# EasyEDA Pro project ProPrj_STM32H730_ESP-Hosted_EVB_2025-02-02.epro, schematic Schematic1

## Sheets
1 Power: Board Name: Board1; Create Date: 2024-12-31; Page Name: Power; Project Name: STM32H730_ESP-Hosted_EVB; Schematic Name: Schematic1; Update Date: 2025-01-24; Company: 嘉立创EDA; Page Size: A4; Version: V1.0
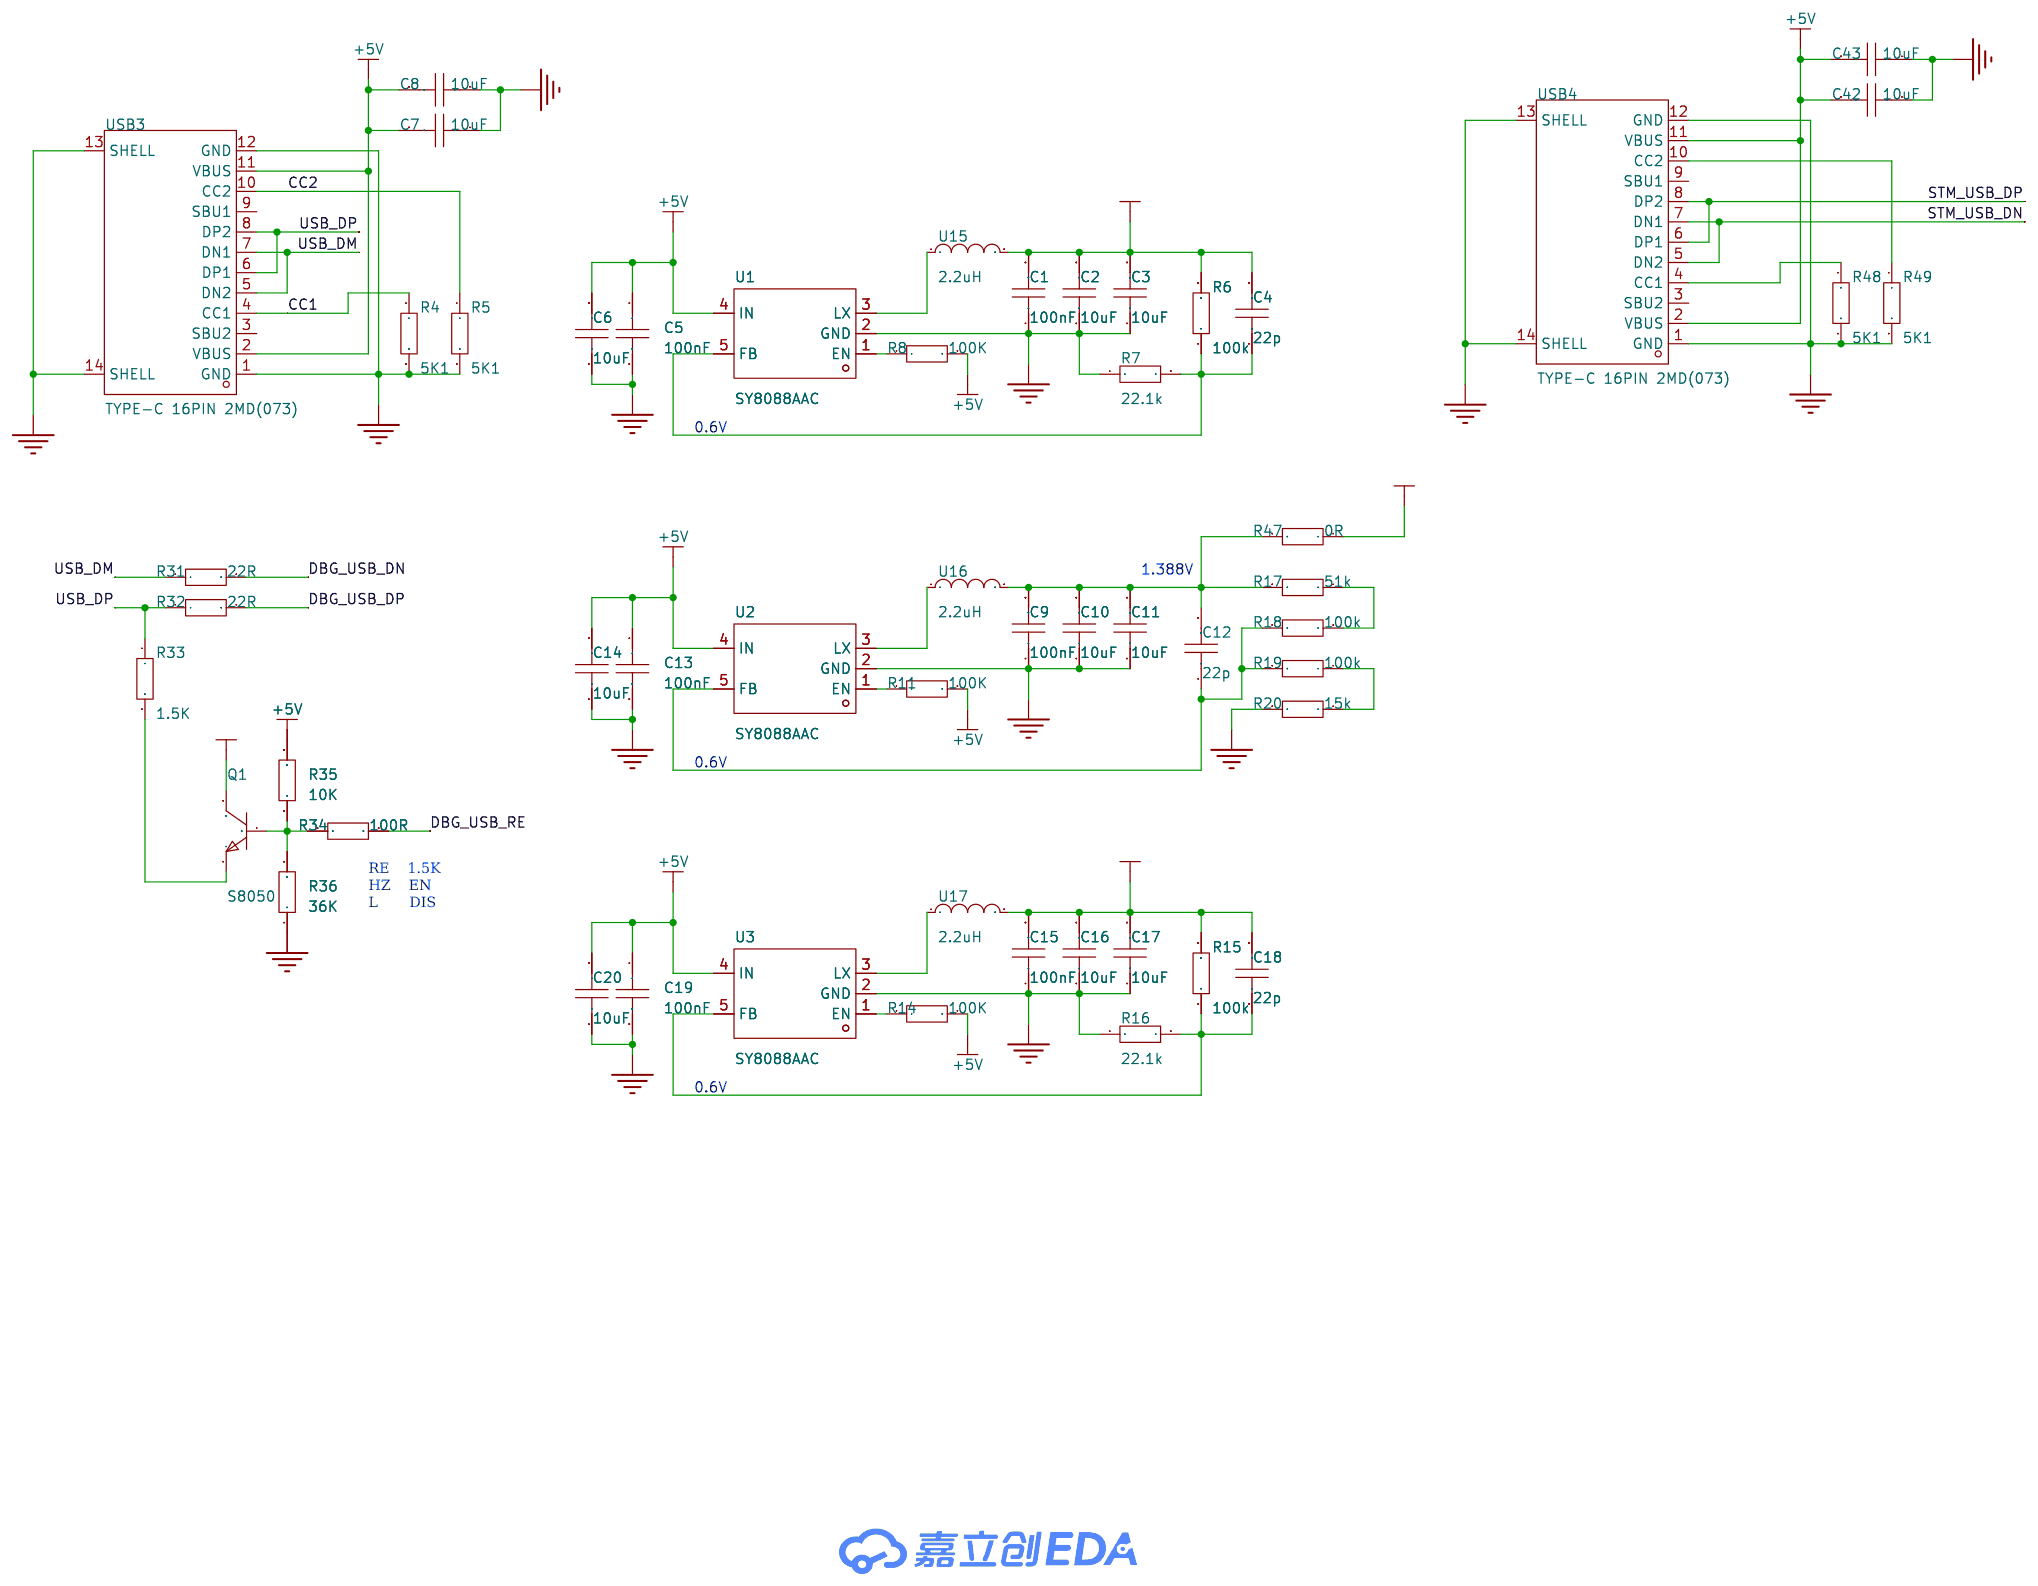
[diagram p0: Power]
2 Debugger: Page Name: Debugger; Update Date: 2025-01-29
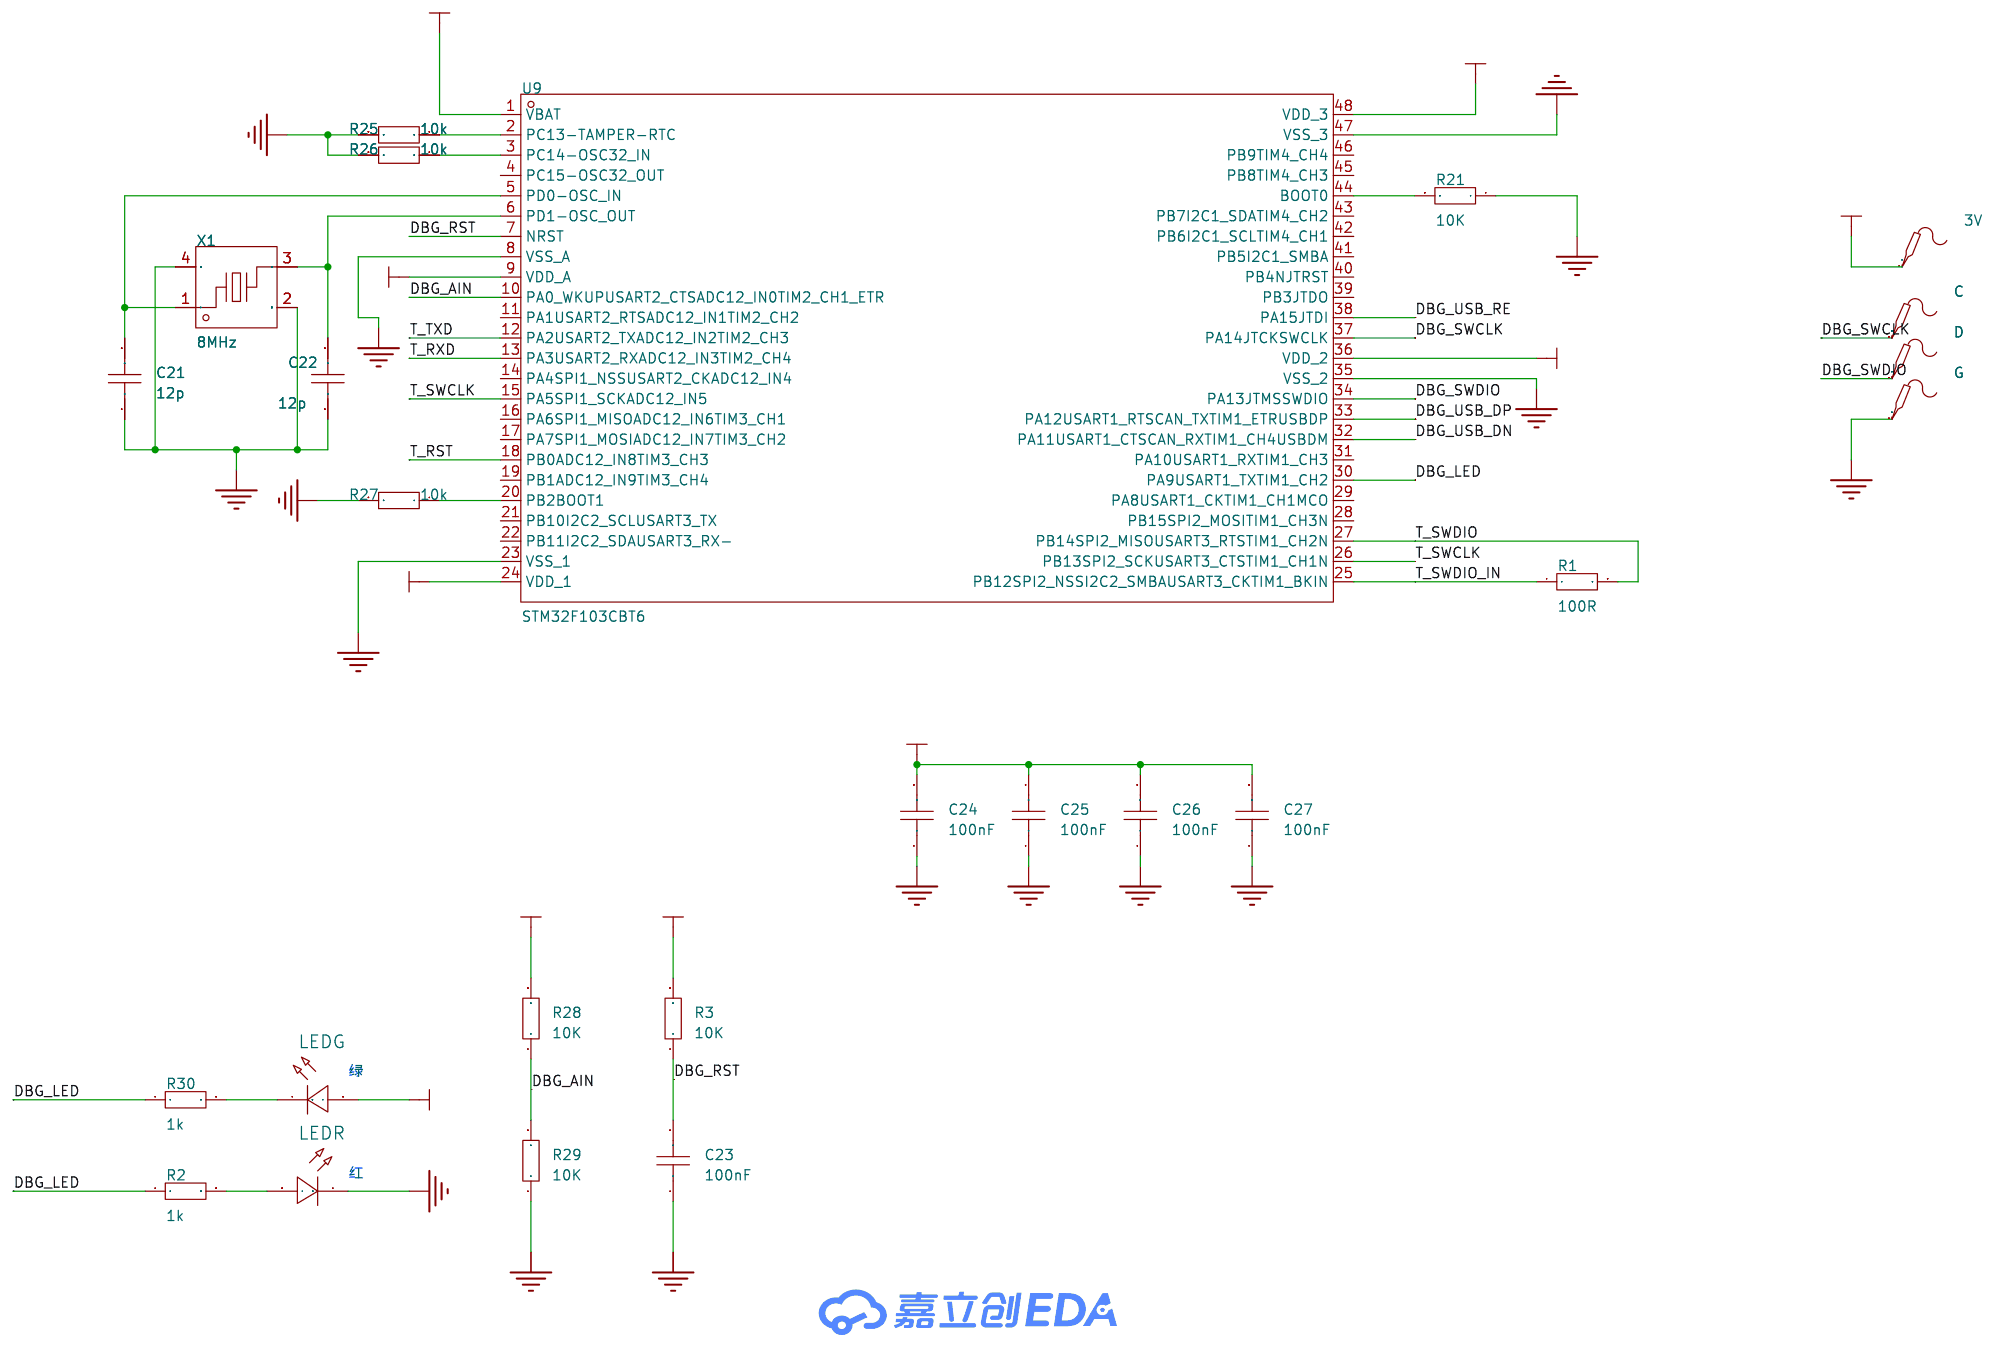
[diagram p1: Debugger]
3 ESP32: Page Name: ESP32; Update Date: 2025-01-29
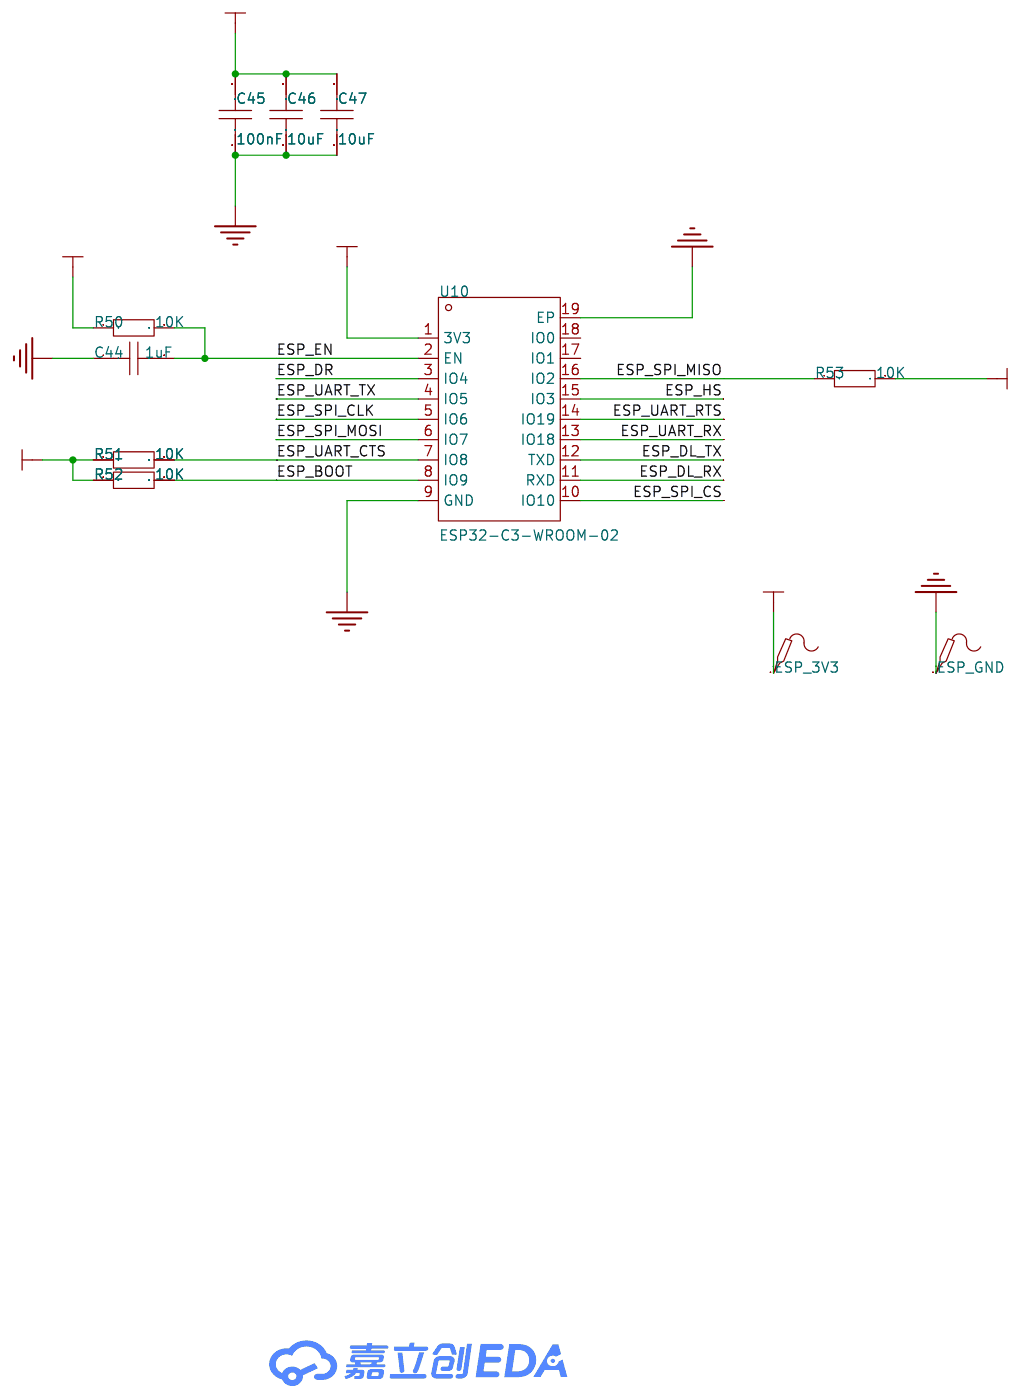
[diagram p2: ESP32]
4 Conn
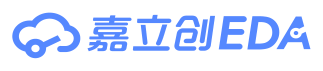
[diagram p3: Conn]
5 MCU: Create Date: 2025-01-01; Page Name: MCU; Update Date: 2025-01-29
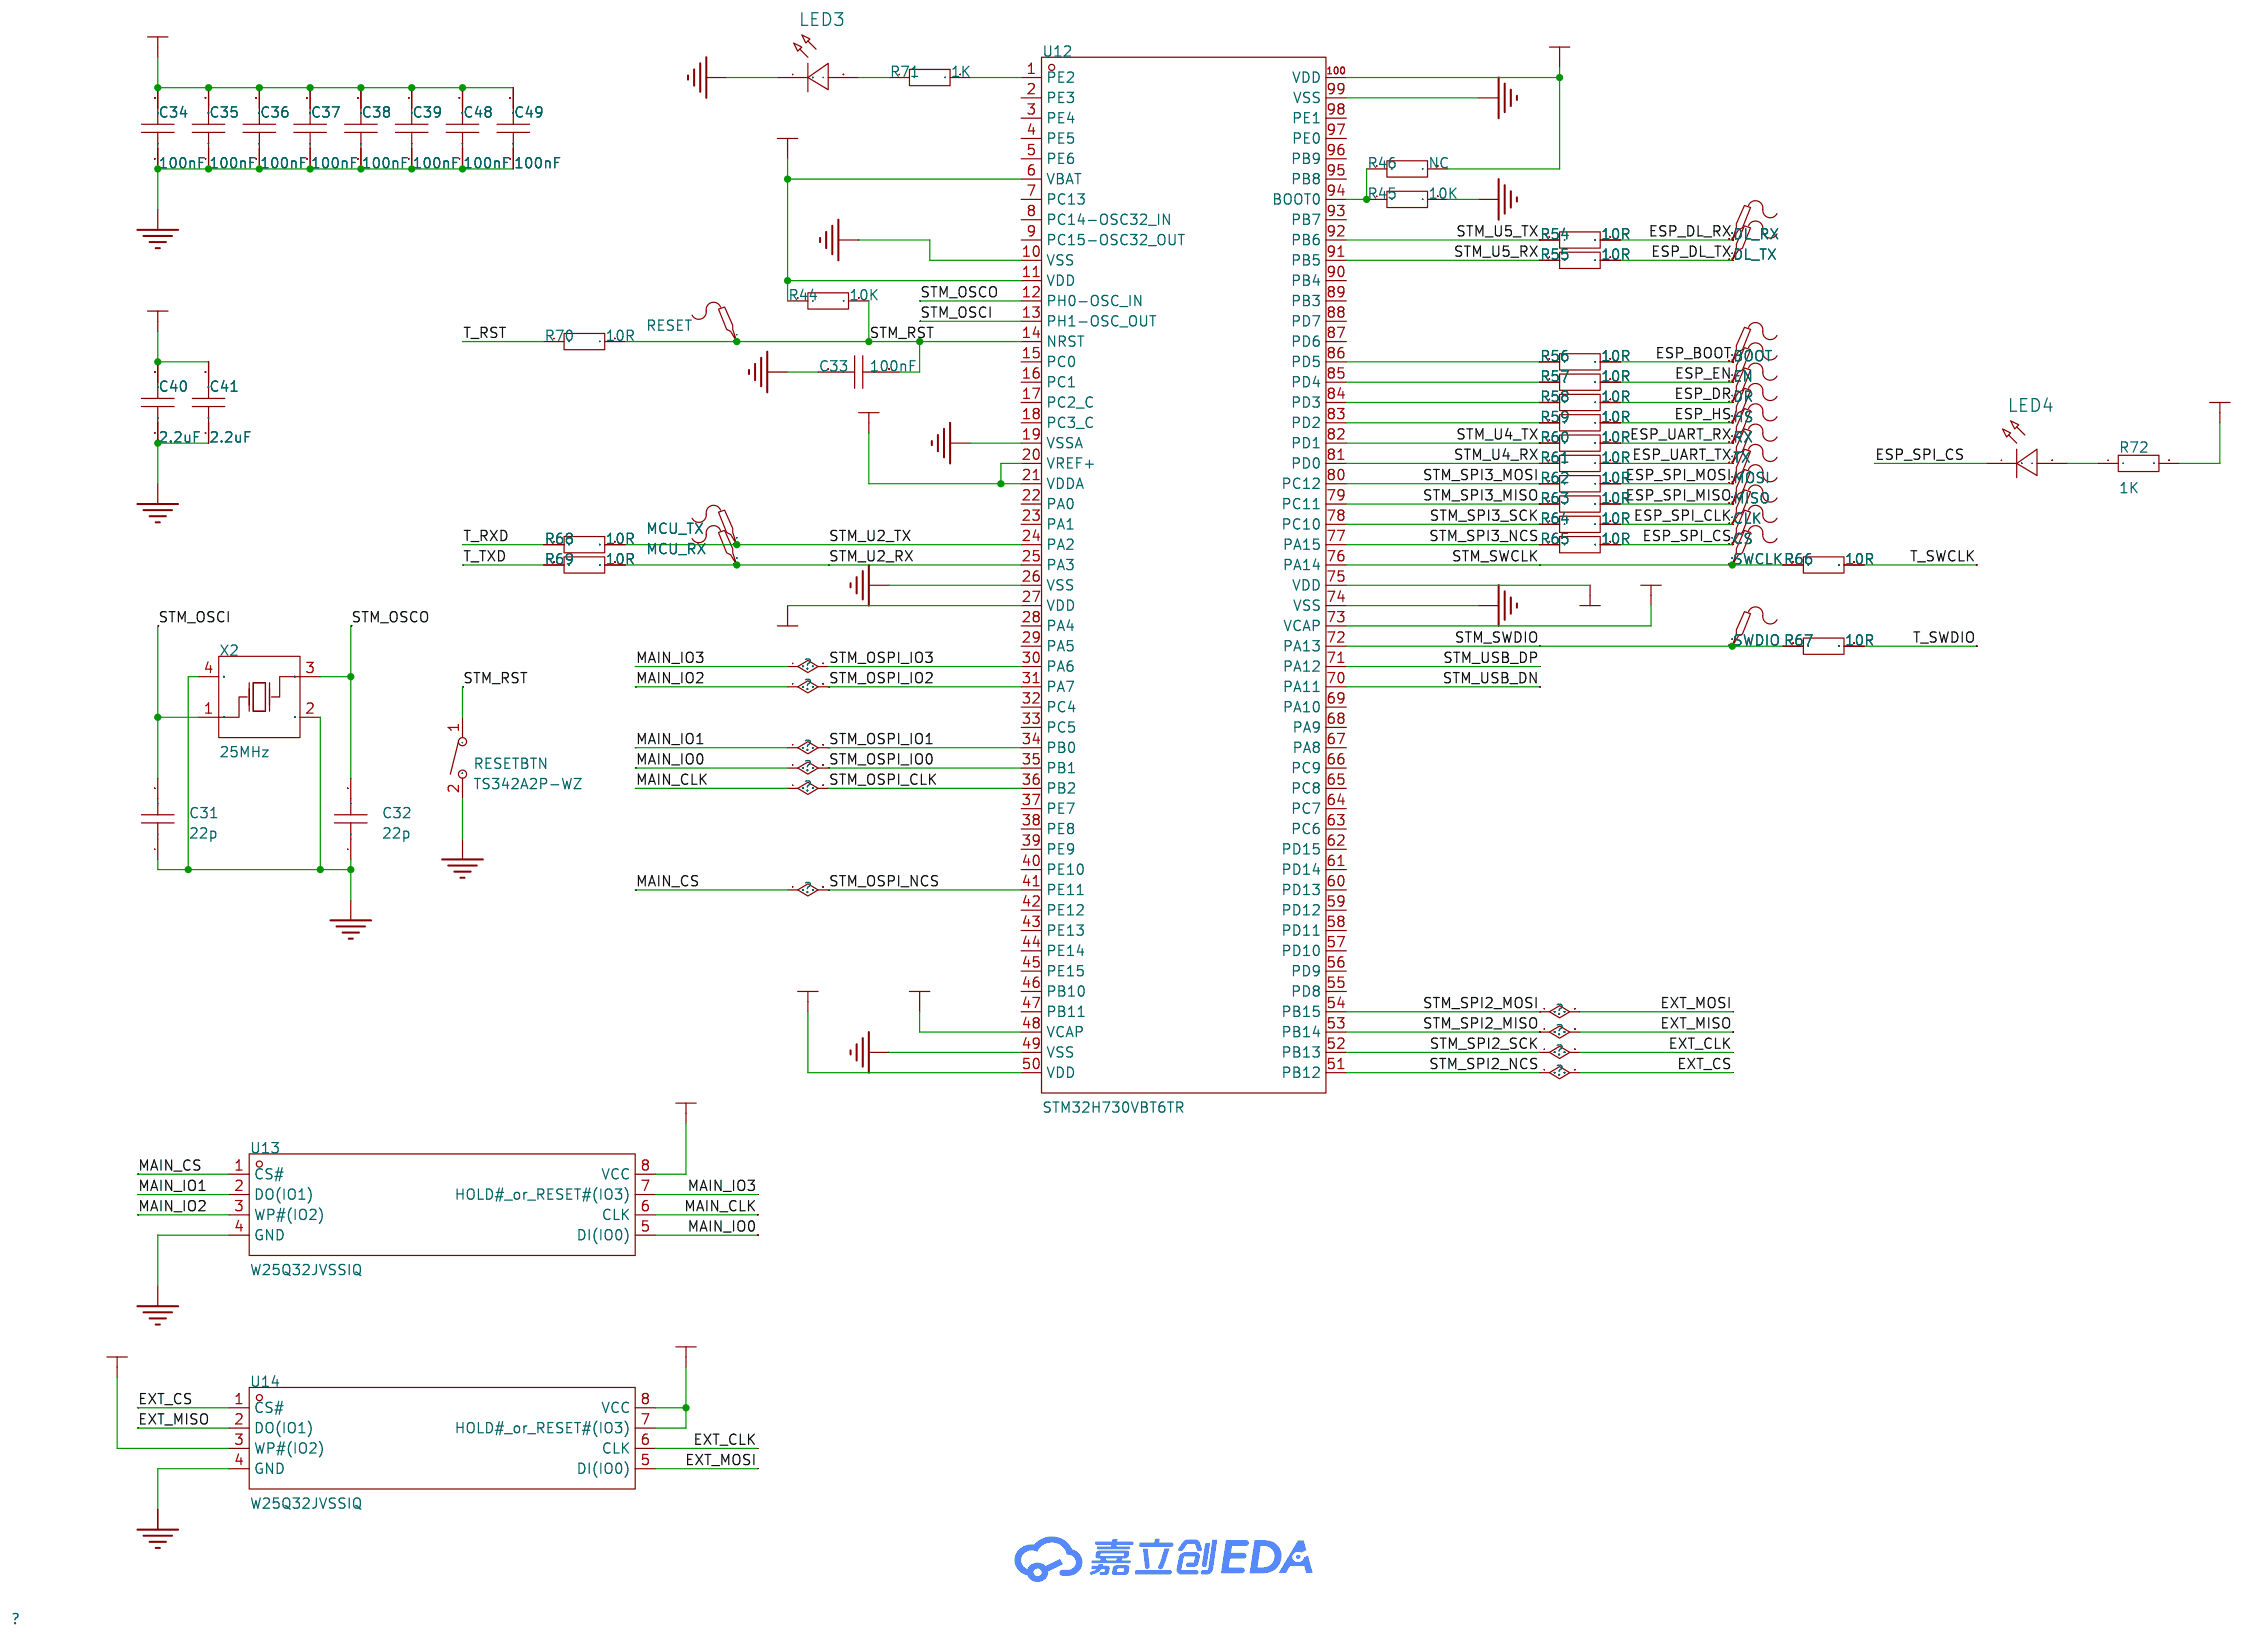
[diagram p4: MCU]

## Parts
sheet Debugger
3V  -  [Test-Point-0.5mm]
C  -  [Test-Point-0.5mm]
C21  12p  [C0603]
C22  12p  [C0603]
C23  100nF  [C0603]
C24  100nF  [C0603]
C25  100nF  [C0603]
C26  100nF  [C0603]
C27  100nF  [C0603]
D  -  [Test-Point-0.5mm]
G  -  [Test-Point-0.5mm]
LEDG  -  [LED_0603]
LEDR  -  [LED_0603]
R1  100R  [R0603]
R2  1k  [R0603]
R3  10K  [R0603]
R21  10K  [R0603]
R25  10k  [R0603]
R26  10k  [R0603]
R27  10k  [R0603]
R28  10K  [R0603]
R29  10K  [R0603]
R30  1k  [R0603]
U9  STM32F103CBT6  [LQFP-48_L7.0-W7.0-P0.50-LS9.0-BL]
X1  8MHz  [OSC-SMD_4P-L3.2-W2.5-BL]
sheet ESP32
C44  1uF  [C0603]
C45  100nF  [C0603]
C46  10uF  [C0603]
C47  10uF  [C0603]
ESP_3V3  -  [Test-Point-0.5mm]
ESP_GND  -  [Test-Point-0.5mm]
R50  10K  [R0603]
R51  10K  [R0603]
R52  10K  [R0603]
R53  10K  [R0603]
U10  ESP32-C3-WROOM-02  [BULETM-SMD_ESPRESSIF_ESP32-C3-WROOM-02-N4-4MB]
sheet MCU
BOOT  -  [Test-Point-0.5mm]
C31  22p  [C0603]
C32  22p  [C0603]
C33  100nF  [C0603]
C34  100nF  [C0603]
C35  100nF  [C0603]
C36  100nF  [C0603]
C37  100nF  [C0603]
C38  100nF  [C0603]
C39  100nF  [C0603]
C40  2.2uF  [C0603]
C41  2.2uF  [C0603]
C48  100nF  [C0603]
C49  100nF  [C0603]
CLK  -  [Test-Point-0.5mm]
CS  -  [Test-Point-0.5mm]
DL_RX  -  [Test-Point-0.5mm]
DL_TX  -  [Test-Point-0.5mm]
DR  -  [Test-Point-0.5mm]
EN  -  [Test-Point-0.5mm]
HS  -  [Test-Point-0.5mm]
LED3  -  [LED_0603]
LED4  -  [LED_0603]
MCU_RX  -  [Test-Point-0.5mm]
MCU_TX  -  [Test-Point-0.5mm]
MISO  -  [Test-Point-0.5mm]
MOSI  -  [Test-Point-0.5mm]
R44  10K  [R0603]
R45  10K  [R0603]
R46  NC  [R0603]
R54  10R  [R0603]
R55  10R  [R0603]
R56  10R  [R0603]
R57  10R  [R0603]
R58  10R  [R0603]
R59  10R  [R0603]
R60  10R  [R0603]
R61  10R  [R0603]
R62  10R  [R0603]
R63  10R  [R0603]
R64  10R  [R0603]
R65  10R  [R0603]
R66  10R  [R0603]
R67  10R  [R0603]
R68  10R  [R0603]
R69  10R  [R0603]
R70  10R  [R0603]
R71  1K  [R0603]
R72  1K  [R0603]
RESET  -  [Test-Point-0.5mm]
RESETBTN  TS342A2P-WZ  [SW-SMD_L4.0-W2.9-LS5.0]
RX  -  [Test-Point-0.5mm]
SWCLK  -  [Test-Point-0.5mm]
SWDIO  -  [Test-Point-0.5mm]
TX  -  [Test-Point-0.5mm]
U12  STM32H730VBT6TR  [LQFP-100_L14.0-W14.0-P0.50-LS16.0-BL]
U13  W25Q32JVSSIQ  [SOIC-8_L5.3-W5.3-P1.27-LS8.0-BL]
U14  W25Q32JVSSIQ  [SOIC-8_L5.3-W5.3-P1.27-LS8.0-BL]
X2  25MHz  [OSC-SMD_4P-L3.2-W2.5-BL]
sheet Power
C1  100nF  [C0603]
C2  10uF  [C0603]
C3  10uF  [C0603]
C4  22p  [C0603]
C5  100nF  [C0603]
C6  10uF  [C0603]
C7  10uF  [C0603]
C8  10uF  [C0603]
C9  100nF  [C0603]
C10  10uF  [C0603]
C11  10uF  [C0603]
C12  22p  [C0603]
C13  100nF  [C0603]
C14  10uF  [C0603]
C15  100nF  [C0603]
C16  10uF  [C0603]
C17  10uF  [C0603]
C18  22p  [C0603]
C19  100nF  [C0603]
C20  10uF  [C0603]
C42  10uF  [C0603]
C43  10uF  [C0603]
Q1  S8050  [SOT-23-3_L3.0-W1.7-P0.95-LS2.9-BR]
R4  5K1  [R0603]
R5  5K1  [R0603]
R6  100k  [R0603]
R7  22.1k  [R0603]
R8  100K  [R0603]
R11  100K  [R0603]
R14  100K  [R0603]
R15  100k  [R0603]
R16  22.1k  [R0603]
R17  51k  [R0603]
R18  100k  [R0603]
R19  100k  [R0603]
R20  15k  [R0603]
R31  22R  [R0603]
R32  22R  [R0603]
R33  1.5K  [R0603]
R34  100R  [R0603]
R35  10K  [R0603]
R36  36K  [R0603]
R47  0R  [R0603]
R48  5K1  [R0603]
R49  5K1  [R0603]
U1  SY8088AAC  [SOT-23-5_L3.0-W1.7-P0.95-LS2.8-BR]
U2  SY8088AAC  [SOT-23-5_L3.0-W1.7-P0.95-LS2.8-BR]
U3  SY8088AAC  [SOT-23-5_L3.0-W1.7-P0.95-LS2.8-BR]
U15  2.2uH  [IND-SMD_L2.5-W2.0]
U16  2.2uH  [IND-SMD_L2.5-W2.0]
U17  2.2uH  [IND-SMD_L2.5-W2.0]
USB3  TYPE-C 16PIN 2MD(073)  [USB-C-SMD_TYPE-C-6PIN-2MD-073]
USB4  TYPE-C 16PIN 2MD(073)  [USB-C-SMD_TYPE-C-6PIN-2MD-073]

## Library data of the parts
3V BOOT C CLK CS D DL_RX DL_TX DR EN ESP_3V3 ESP_GND G HS MCU_RX MCU_TX MISO MOSI RESET RX SWCLK SWDIO TX = Test-Point: Test Point 测试点
C1-C27 C31-C49 = CAP_0603: Supplier Footprint: 0603
LED3 LED4 LEDG LEDR = LED_0603-R: Supplier Footprint: 0603
R1-R8 R11 R14-R21 R25-R36 R44-R72 = Res_0603: Supplier Footprint: 0603
U9 = STM32F103CBT6: CPU内核:CM3;程序存储容量:128KB;RAM总容量:20KB;GPIO端口数量:37;工作电压范围:2V~3.6V;CPU最大主频:72MHz;程序存储器类型:FLASH;; Supplier Part: C8304; Manufacturer: ST(意法半导体); Supplier Footprint: LQFP-48(7x7); JLCPCB Part Class: 扩展库; Datasheet: https://atta.szlcsc.com/upload/public/pdf/source/20150811/1457707344439.pdf; Supplier: LCSC; CPU Core: CM3; Program Storage Size: 128KB; RAM Size: 20KB; GPIO Ports Number: 37; Operating Voltage Range: 2V~3.6V; CPU Maximum Speed: 72MHz; Program Memory Type: FLASH; Operating Temperature Range: -40℃~+85℃; ADC (Bit): 12bit; Universal Serial Bus: 有; Peripheral/Function: DMA；片载温度传感器；PWM; Watchdog: 有; Infrared Data Association: 有; Low-Voltage Detect: 有; Direct Memory Access: 有; Internal Oscillator: 有
X1 = X32258MOB4SI: 频率:8MHz;频率公差:±10ppm;负载电容:12pF;; LCSC Part Name: 8MHz ±10ppm 12pF YSX321SL; Supplier Part: C2682775; Manufacturer: YXC(扬兴晶振); Supplier Footprint: SMD3225-4P; Datasheet: https://atta.szlcsc.com/upload/public/pdf/source/20210106/C2682774_0CD4FDA5D9DA3FBEEC23BD607A48E4B0.pdf; Supplier: LCSC; Crystal Type: 贴片无源晶振; Frequency Tolerance: ±10ppm; Frequency Stability: ±30ppm; Load Capacitance: 12pF; Equivalent Series Resistance (ESR): 150Ω; Operating Temperature: -40℃~+85℃
U10 = ESP32-C3-WROOM-02-N4: 核心处理器:ESP32-C3芯片;频率:2.4GHz;发射功率:20.5dBm;; Supplier Part: C2934560; Manufacturer: ESPRESSIF(乐鑫); Supplier Footprint: VFQFN-32-EP; JLCPCB Part Class: 扩展库; Datasheet: https://atta.szlcsc.com/upload/public/pdf/source/20220106/F07459EFFE1D7CBA94B4FB8A075146A6.pdf; Supplier: LCSC; Core Processor: ESP32-C3芯片; Support Interface: I2C；GPIO；SPI；JTAG；UART；USB；I2S; Output Power: 20.5dBm
RESETBTN = TS342A2P-WZ: 电路结构:单刀单掷;按钮形状:圆形按钮;安装方式:立贴;开关长度:3.95mm;开关宽度:2.9mm;开关高度:2mm;带支架:不带;触点电流:50mA;额定电压(DC):12V;绝缘电阻:100MΩ;机械寿命:3万次;; LCSC Part Name: 3.95*2.9*2mm 立贴 轻触开关; Supplier Part: C557591; Manufacturer: SHOU HAN(首韩); Supplier Footprint: SMD; JLCPCB Part Class: 扩展库; Datasheet: https://atta.szlcsc.com/upload/public/pdf/source/20200519/C557591_B3A5A21584733303F06306F18577DA8B.pdf; Supplier: LCSC; Circuit: 单刀单掷; Actuator Style: 圆形按钮; Mounting Style: 立贴; Switch Length: 3.95mm; Switch Width: 2.9mm; Switch Height: 2mm; Strike Gundam: 不带; Contact Current: 50mA; Voltage Rating (DC): 12V; Insulation Resistance: 100MΩ; Actuator/Cap Color: 黑色; Pin Style: SMD接片; Mechanical Life: 3万次; Operating Temperature: -25℃~+70℃
U12 = STM32H730VBT6TR: CPU内核:ARM-M系列;GPIO端口数量:80;工作电压范围:1.71V~3.6V;CPU最大主频:550MHz;; Supplier Part: C5931908; Manufacturer: ST(意法半导体); Supplier Footprint: LQFP-100(14x14); JLCPCB Part Class: 扩展库; Supplier: LCSC; CPU Core: ARM-M系列; GPIO Ports Number: 80; Operating Voltage Range: 1.71V~3.6V; CPU Maximum Speed: 550MHz; Operating Temperature Range: -40℃~+85℃; ADC (Bit): 12bit；16bit; DAC (Bit): 12bit; Universal Serial Bus: 有; Secure Digital Input and Output: 有; Direct Memory Access: 有
U13 U14 = W25Q32JVSSIQ: Supplier Part: C179173; Manufacturer: WINBOND(华邦); Supplier Footprint: SOP-8-208mil; JLCPCB Part Class: 扩展库; Datasheet: https://atta.szlcsc.com/upload/public/pdf/source/20191218/C179173_5BBD793D2D7B3672E140BC7AE85C11FF.pdf; Supplier: LCSC
X2 = X322525MOB4SI: 晶振类型:贴片晶振;频率:25MHz;常温频差:±10ppm;外接负载电容:12pF;频率稳定度(全温):±30ppm;; LCSC Part Name: 25MHz ±10ppm 12pF; Supplier Part: C9006; Manufacturer: YXC(扬兴晶振); Supplier Footprint: SMD3225-4P; JLCPCB Part Class: 基础库; Datasheet: https://atta.szlcsc.com/upload/public/pdf/source/20210329/C112971_1F611BDC486E193C1706F6D8EB5AA189.pdf; Supplier: LCSC; Crystal Type: 贴片晶振; Normal temperature Frequency Tolerance: ±10ppm; External load capacitor: 12pF; Frequency Stability(Full temperature range): ±30ppm; Operating Temperature: -40℃~+85℃
Q1 = S8050 J3Y(RANGE:200-350): 晶体管类型:NPN;集电极电流(Ic):500mA;集射极击穿电压(Vceo):25V;功率(Pd):300mW;直流电流增益(hFE@Ic,Vce):200@500mA,1V;; LCSC Part Name: NPN 电流:500mA 耐压:25V H档(200-350); Supplier Part: C2146; Manufacturer: CJ(江苏长电/长晶); Supplier Footprint: SOT-23; JLCPCB Part Class: 基础库; Datasheet: https://atta.szlcsc.com/upload/public/pdf/source/20231013/FF37B6A000E6CDA75C9C999D2E78731F.pdf; Supplier: LCSC; Transistor Type: NPN; Collector Current (Ic): 500mA; Collector-Emitter Breakdown Voltage (Vceo): 25V; Power Dissipation (Pd): 300mW; DC Current Gain (hFE@Ic,Vce): 200@500mA,1V; Transition Frequency (fT): 150MHz; Collector Cut-Off Current (Icbo): 100nA; Collector-Emitter Saturation Voltage (VCE(sat)@Ic,Ib): 600mV@500mA,50mA; Operating Temperature: -55℃~+150℃
U1-U3 = SY8088AAC: 功能类型:降压型;输出类型:-;工作电压:2.5V~5.5V;输出电压:-;输出电流:-;; LCSC Part Name: 1.5MHz 1A 同步降压DC/DC调节器; Supplier Part: C79313; Manufacturer: silergy(矽力杰); Supplier Footprint: SOT-23-5; JLCPCB Part Class: 扩展库; Datasheet: https://atta.szlcsc.com/upload/public/pdf/source/20170329/1490752163260.pdf; Supplier: LCSC; Function: 降压型; Input Voltage: 2.5V~5.5V; Switching Frequency: 1.5MHz; Operating Temperature: -40℃~+125℃; Synchronous Rectification: 是; Number of Outputs: 1; Topology: 降压式; Quiescent Current (Iq): 40uA
U15-U17 = FTC252012S3R3MBCA: 电感值:3.3uH;精度:±20%;额定电流:2.3A;饱和电流(Isat):3A;类型:一体成型电感;; LCSC Part Name: 3.3uH ±20% 3A; Supplier Part: C5832373; Manufacturer: cjiang(长江微电); Supplier Footprint: SMD,2x2.5mm; JLCPCB Part Class: 扩展库; Datasheet: https://atta.szlcsc.com/upload/public/pdf/source/20230602/8FFEDA9C0247A92A0D4B67554BFE4091.pdf; Supplier: LCSC; Tolerance: ±20%; Rated Current: 2.3A; Saturation Current (Isat): 3A; DC Resistance (DCR): 80mΩ; Type: 一体成型电感
USB3 USB4 = TYPE-C 16PIN 2MD(073): 连接器类型:Type-C;标准:-;公母:母;触点数量:16P;端口数量:1;安装方式:卧贴;额定电流 - 电源:5A;工作温度范围:-25℃~+85℃;; LCSC Part Name: Type-C 母 卧贴 带定位柱 不锈钢外壳 2次模顶; Supplier Part: C2765186; Manufacturer: SHOU HAN(首韩); Supplier Footprint: SMD; JLCPCB Part Class: 扩展库; Datasheet: https://atta.szlcsc.com/upload/public/pdf/source/20211123/39B17C16241EAC15C5E277BDA434118E.pdf; Supplier: LCSC; Connector Type: Type-C; Gender: 母; Number of Contacts: 16P; Number of Ports: 1; Mounting Style: 卧贴; Current Rating - Power (Max): 5A; Operating Temperature Range: -25℃~+85℃

## Nets
+3.3V_ESP: C15.2 C16.2 C17.2 C18.2 C45.2 C46.2 C47.2 ESP_3V3.1 R15.2 R50.1 R51.1 R52.1 R53.2 U10.1(3V3) U17.2
+3.3V_MCU: 3V.1 C1.2 C2.2 C3.2 C4.2 C24.2 C25.2 C26.2 C27.2 C34.2 C35.2 C36.2 C37.2 C38.2 C39.2 C48.2 C49.2 LEDG.2(A) Q1.3(C) R3.2 R6.2 R28.2 R44.1 R46.2 R72.2 U9.1(VBAT) U9.9(VDD_A) U9.24(VDD_1) U9.36(VDD_2) U9.48(VDD_3) U12.6(VBAT) U12.11(VDD) U12.20(VREF+) U12.21(VDDA) U12.27(VDD) U12.50(VDD) U12.75(VDD) U12.100(VDD) U13.8(VCC) U14.3(WP#(IO2)) U14.7(HOLD# or RESET#(IO3)) U14.8(VCC) U15.2
+5V: C5.1 C6.2 C7.2 C8.2 C13.1 C14.2 C19.1 C20.2 C42.2 C43.2 R8.2 R11.2 R14.2 R35.2 U1.4(IN) U2.4(IN) U3.4(IN) USB3.2(VBUS) USB3.11(VBUS) USB4.2(VBUS) USB4.11(VBUS)
GND: C1.1 C2.1 C3.1 C5.2 C6.1 C7.1 C8.1 C9.1 C10.1 C11.1 C13.2 C14.1 C15.1 C16.1 C17.1 C19.2 C20.1 C21.1 C22.1 C23.1 C24.1 C25.1 C26.1 C27.1 C31.1 C32.1 C33.1 C34.1 C35.1 C36.1 C37.1 C38.1 C39.1 C40.1 C41.1 C42.1 C43.1 C44.1 C45.1 C46.1 C47.1 C48.1 C49.1 ESP_GND.1 G.1 LED3.1(C) LEDR.1(C) R4.2 R5.2 R7.1 R16.1 R20.2 R21.1 R25.2 R26.2 R27.2 R29.1 R36.1 R45.2 R48.2 R49.2 RESETBTN.2 U1.2(GND) U2.2(GND) U3.2(GND) U9.8(VSS_A) U9.23(VSS_1) U9.35(VSS_2) U9.47(VSS_3) U10.9(GND) U10.19(EP) U12.10(VSS) U12.19(VSSA) U12.26(VSS) U12.49(VSS) U12.74(VSS) U12.99(VSS) U13.4(GND) U14.4(GND) USB3.1(GND) USB3.12(GND) USB3.13(SHELL) USB3.14(SHELL) USB4.1(GND) USB4.12(GND) USB4.13(SHELL) USB4.14(SHELL) X1.2(GND) X1.4(GND) X2.2(GND) X2.4(GND)
+VCAP_MCU: C40.2 C41.2 R47.1 U12.48(VCAP) U12.73(VCAP)
CC1: R4.1 USB3.4(CC1)
CC2: R5.1 USB3.10(CC2)
DBG_AIN: R28.1 R29.2 U9.10(PA0_WKUPUSART2_CTSADC12_IN0TIM2_CH1_ETR)
DBG_LED: R2.1 R30.1 U9.30(PA9USART1_TXTIM1_CH2)
DBG_RST: C23.2 R3.1 U9.7(NRST)
DBG_SWCLK: C.1 U9.37(PA14JTCKSWCLK)
DBG_SWDIO: D.1 U9.34(PA13JTMSSWDIO)
DBG_USB_DN: R31.2 U9.32(PA11USART1_CTSCAN_RXTIM1_CH4USBDM)
DBG_USB_DP: R32.2 U9.33(PA12USART1_RTSCAN_TXTIM1_ETRUSBDP)
DBG_USB_RE: R34.2 U9.38(PA15JTDI)
ESP_BOOT: BOOT.1 R52.2 R56.2 U10.8(IO9)
ESP_DL_RX: DL_RX.1 R54.2 U10.11(RXD)
ESP_DL_TX: DL_TX.1 R55.2 U10.12(TXD)
ESP_DR: DR.1 R58.2 U10.3(IO4)
ESP_EN: C44.2 EN.1 R50.2 R57.2 U10.2(EN)
ESP_HS: HS.1 R59.2 U10.15(IO3)
ESP_SPI_CLK: CLK.1 R64.2 U10.5(IO6)
ESP_SPI_CS: CS.1 LED4.1(C) R65.2 U10.10(IO10)
ESP_SPI_MISO: MISO.1 R53.1 R63.2 U10.16(IO2)
ESP_SPI_MOSI: MOSI.1 R62.2 U10.6(IO7)
ESP_UART_CTS: R51.2 U10.7(IO8)
ESP_UART_RTS: U10.14(IO19)
ESP_UART_RX: R60.2 RX.1 U10.13(IO18)
ESP_UART_TX: R61.2 TX.1 U10.4(IO5)
EXT_CLK: U12.52(PB13) U14.6(CLK)
EXT_CS: U12.51(PB12) U14.1(CS#)
EXT_MISO: U12.53(PB14) U14.2(DO(IO1))
EXT_MOSI: U12.54(PB15) U14.5(DI(IO0))
MAIN_CLK: U12.36(PB2) U13.6(CLK)
MAIN_CS: U12.41(PE11) U13.1(CS#)
MAIN_IO0: U12.35(PB1) U13.5(DI(IO0))
MAIN_IO1: U12.34(PB0) U13.2(DO(IO1))
MAIN_IO2: U12.31(PA7) U13.3(WP#(IO2))
MAIN_IO3: U12.30(PA6) U13.7(HOLD# or RESET#(IO3))
STM_OSCI: C31.2 U12.13(PH1-OSC_OUT) X2.1(OSC1)
STM_OSCO: C32.2 U12.12(PH0-OSC_IN) X2.3(OSC2)
STM_RST: C33.2 R44.2 R70.2 RESET.1 RESETBTN.1 U12.14(NRST)
STM_SPI3_MISO: R63.1 U12.79(PC11)
STM_SPI3_MOSI: R62.1 U12.80(PC12)
STM_SPI3_NCS: R65.1 U12.77(PA15)
STM_SPI3_SCK: R64.1 U12.78(PC10)
STM_SWCLK: R66.1 SWCLK.1 U12.76(PA14)
STM_SWDIO: R67.1 SWDIO.1 U12.72(PA13)
STM_U2_RX: MCU_RX.1 R69.2 U12.25(PA3)
STM_U2_TX: MCU_TX.1 R68.2 U12.24(PA2)
STM_U4_RX: R61.1 U12.81(PD0)
STM_U4_TX: R60.1 U12.82(PD1)
STM_U5_RX: R55.1 U12.91(PB5)
STM_U5_TX: R54.1 U12.92(PB6)
STM_USB_DN: U12.70(PA11) USB4.5(DN2) USB4.7(DN1)
STM_USB_DP: U12.71(PA12) USB4.6(DP1) USB4.8(DP2)
T_RST: R70.1 U9.18(PB0ADC12_IN8TIM3_CH3)
T_RXD: R68.1 U9.13(PA3USART2_RXADC12_IN3TIM2_CH4)
T_SWCLK: R66.2 U9.15(PA5SPI1_SCKADC12_IN5) U9.26(PB13SPI2_SCKUSART3_CTSTIM1_CH1N)
T_SWDIO: R1.2 R67.2 U9.27(PB14SPI2_MISOUSART3_RTSTIM1_CH2N)
T_SWDIO_IN: R1.1 U9.25(PB12SPI2_NSSI2C2_SMBAUSART3_CKTIM1_BKIN)
T_TXD: R69.1 U9.12(PA2USART2_TXADC12_IN2TIM2_CH3)
USB_DM: R31.1 USB3.5(DN2) USB3.7(DN1)
USB_DP: R32.1 R33.1 USB3.6(DP1) USB3.8(DP2)
$1N409: U1.3(LX) U15.1
$1N668: C4.1 R6.1 R7.2 U1.5(FB)
$1N790: R8.1 U1.1(EN)
$1N1374: U2.3(LX) U16.1
$1N1377: C9.2 C10.2 C11.2 C12.2 R17.2 R47.2 U16.2
$1N1393: C12.1 R18.2 R19.2 U2.5(FB)
$1N1402: R11.1 U2.1(EN)
$1N1779: U3.3(LX) U17.1
$1N1798: C18.1 R15.1 R16.2 U3.5(FB)
$1N1807: R14.1 U3.1(EN)
$1N2536: R17.1 R18.1
$1N2550: R19.1 R20.1
$1N2789: Q1.2(E) R33.2
$1N2864: Q1.1(B) R34.1 R35.1 R36.2
$1N5010: R48.1 USB4.4(CC1)
$1N5011: R49.1 USB4.10(CC2)
$2N1341: LEDR.2(A) R2.2
$2N1351: R21.2 U9.44(BOOT0)
$2N1378: C22.2 U9.6(PD1-OSC_OUT) X1.3
$2N1379: C21.2 U9.5(PD0-OSC_IN) X1.1
$2N1471: R25.1 U9.2(PC13-TAMPER-RTC)
$2N1475: R26.1 U9.3(PC14-OSC32_IN)
$2N1617: R27.1 U9.20(PB2BOOT1)
$2N1805: LEDG.1(C) R30.2
$5N2075: R45.1 R46.1 U12.94(BOOT0)
$5N5771: R56.1 U12.86(PD5)
$5N5804: R57.1 U12.85(PD4)
$5N5834: R58.1 U12.84(PD3)
$5N5864: R59.1 U12.83(PD2)
$5N11116: R71.2 U12.1(PE2)
$5N11170: LED3.2(A) R71.1
$5N11241: LED4.2(A) R72.1

Not connected (* = marked no-connect by the designer): U9 4(PC15-OSC32_OUT) 11(PA1USART2_RTSADC12_IN1TIM2_CH2) 14(PA4SPI1_NSSUSART2_CKADC12_IN4) 16(PA6SPI1_MISOADC12_IN6TIM3_CH1) 17(PA7SPI1_MOSIADC12_IN7TIM3_CH2) 19(PB1ADC12_IN9TIM3_CH4) 21(PB10I2C2_SCLUSART3_TX) 22(PB11I2C2_SDAUSART3_RX-) 28(PB15SPI2_MOSITIM1_CH3N) 29(PA8USART1_CKTIM1_CH1MCO) 31(PA10USART1_RXTIM1_CH3) 39(PB3JTDO) 40(PB4NJTRST) 41(PB5I2C1_SMBA) 42(PB6I2C1_SCLTIM4_CH1) 43(PB7I2C1_SDATIM4_CH2) 45(PB8TIM4_CH3) 46(PB9TIM4_CH4); U10 17(IO1) 18(IO0); U12 2(PE3) 3(PE4) 4(PE5) 5(PE6) 7(PC13) 8(PC14-OSC32_IN) 9(PC15-OSC32_OUT) 15(PC0) 16(PC1) 17(PC2_C) 18(PC3_C) 22(PA0) 23(PA1) 28(PA4) 29(PA5) 32(PC4) 33(PC5) 37(PE7) 38(PE8) 39(PE9) 40(PE10) 42(PE12) 43(PE13) 44(PE14) 45(PE15) 46(PB10) 47(PB11) 55(PD8) 56(PD9) 57(PD10) 58(PD11) 59(PD12) 60(PD13) 61(PD14) 62(PD15) 63(PC6) 64(PC7) 65(PC8) 66(PC9) 67(PA8) 68(PA9) 69(PA10) 87(PD6) 88(PD7) 89(PB3) 90(PB4) 93(PB7) 95(PB8) 96(PB9) 97(PE0) 98(PE1); USB3 3(SBU2) 9(SBU1); USB4 3(SBU2) 9(SBU1)

## Notes on the sheets
sheet 1
- 0.6V
- 1.388V
- 0.6V
- RE    1.5K
  HZ    EN
  L       DIS
- 0.6V
sheet 2
- 绿
- 红
